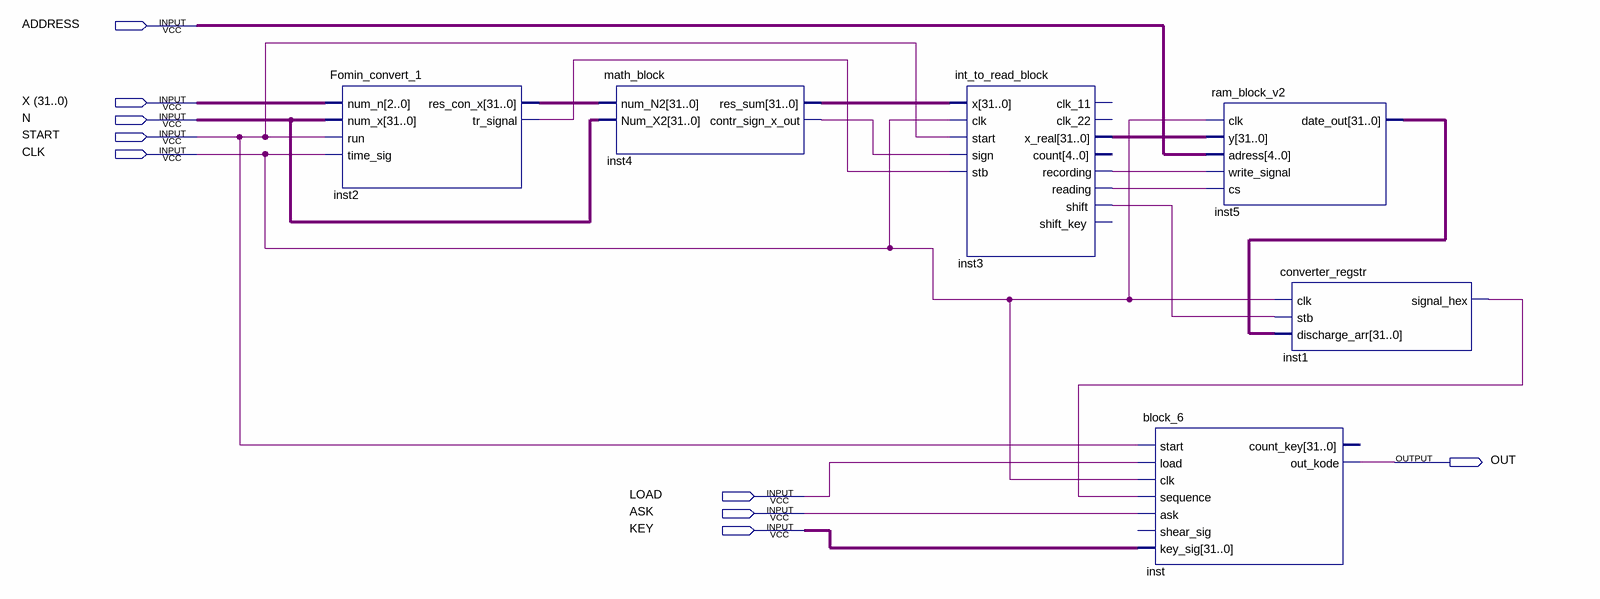
[diagram p0: schematic sheet]
// Quartus schematic add_block.bdf as structural Verilog: 6 symbols, 9 pins
module add_block (
  input  ADDRESS,
  input  \X_(31..0) ,
  input  N,
  input  START,
  input  CLK,
  input  LOAD,
  input  ASK,
  input  KEY,
  output OUT
);

  wire inst1_signal_hex, inst2_tr_signal, inst3_reading, inst3_recording, inst3_shift, inst4_contr_sign_x_out;
  wire [2:0] undriven_2;
  wire [4:0] undriven_3;
  wire [31:0] inst2_res_con_x, inst3_x_real, inst4_res_sum, inst5_date_out, undriven, undriven_4;

  Fomin_convert_1 inst2 (
    .num_n(undriven_2), .num_x(undriven), .run(START), .time_sig(CLK), .res_con_x(inst2_res_con_x),
    .tr_signal(inst2_tr_signal));
  math_block inst4 (
    .num_N2(inst2_res_con_x), .Num_X2(undriven), .res_sum(inst4_res_sum),
    .contr_sign_x_out(inst4_contr_sign_x_out));
  int_to_read_block inst3 (
    .x(inst4_res_sum), .clk(CLK), .start(START), .sign(inst4_contr_sign_x_out), .stb(inst2_tr_signal),
    .x_real(inst3_x_real), .recording(inst3_recording), .reading(inst3_reading), .shift(inst3_shift));  // open: clk_11, clk_22, count, shift_key
  block_6 inst (
    .start(START), .load(LOAD), .clk(CLK), .\sequence (inst1_signal_hex), .ask(ASK), .key_sig(undriven_4),
    .out_kode(OUT));  // open: shear_sig, count_key
  ram_block_v2 inst5 (
    .clk(CLK), .y(inst3_x_real), .adress(undriven_3), .write_signal(inst3_recording), .cs(inst3_reading),
    .date_out(inst5_date_out));
  converter_regstr inst1 (.clk(CLK), .stb(inst3_shift), .discharge_arr(inst5_date_out), .signal_hex(inst1_signal_hex));
endmodule
